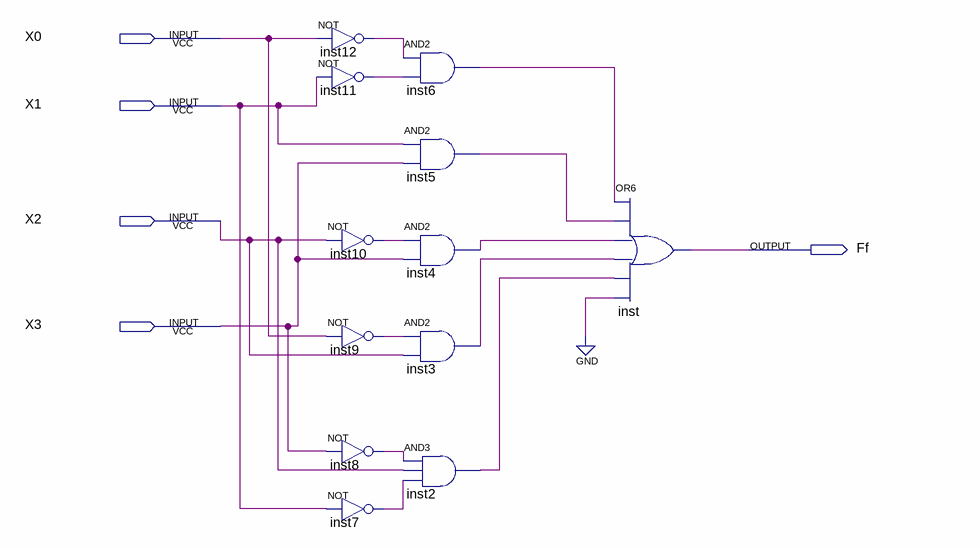
[diagram p0: schematic sheet]
// Quartus schematic Segmento6.bdf as structural Verilog: 12 symbols, 5 pins
module Segmento6 (
  input  X0,
  input  X1,
  input  X2,
  input  X3,
  output Ff
);

  wire inst2_out, inst3_out, inst4_out, inst5_out, inst6_out, inst7_out, inst8_out, inst9_out, inst10_out,
       inst11_out, inst12_out;

  not inst12 (inst12_out, X0);
  not inst11 (inst11_out, X1);
  not inst10 (inst10_out, X2);
  not inst9 (inst9_out, X0);
  not inst8 (inst8_out, X3);
  not inst7 (inst7_out, X1);
  and inst6 (inst6_out, inst12_out, inst11_out);
  and inst5 (inst5_out, X1, X3);
  and inst4 (inst4_out, inst10_out, X3);
  and inst3 (inst3_out, inst9_out, X2);
  and inst2 (inst2_out, inst8_out, X2, inst7_out);
  or inst (Ff, inst6_out, inst5_out, inst4_out, inst3_out, inst2_out, 1'b0);
endmodule
